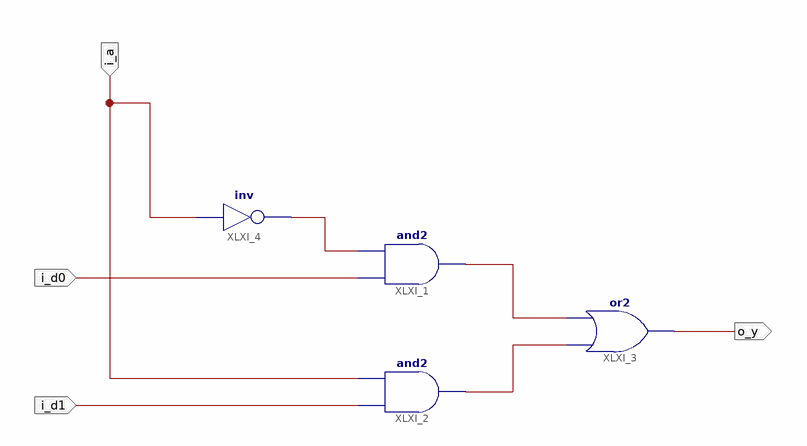
[diagram p0: schematic sheet 1]
// Xilinx ISE schematic Laby6.sch (spartan3e) as structural Verilog: 4 symbols, 4 ports
module Laby6 (
  input  i_d0,
  input  i_a,
  input  i_d1,
  output o_y
);

  wire XLXN_1, XLXN_3, XLXN_4;

  and XLXI_1 (XLXN_3, i_d0, XLXN_1);
  and XLXI_2 (XLXN_4, i_d1, i_a);
  or XLXI_3 (o_y, XLXN_4, XLXN_3);
  not XLXI_4 (XLXN_1, i_a);
endmodule
